# Altium schematic sheet CPU.SchDoc
size A4
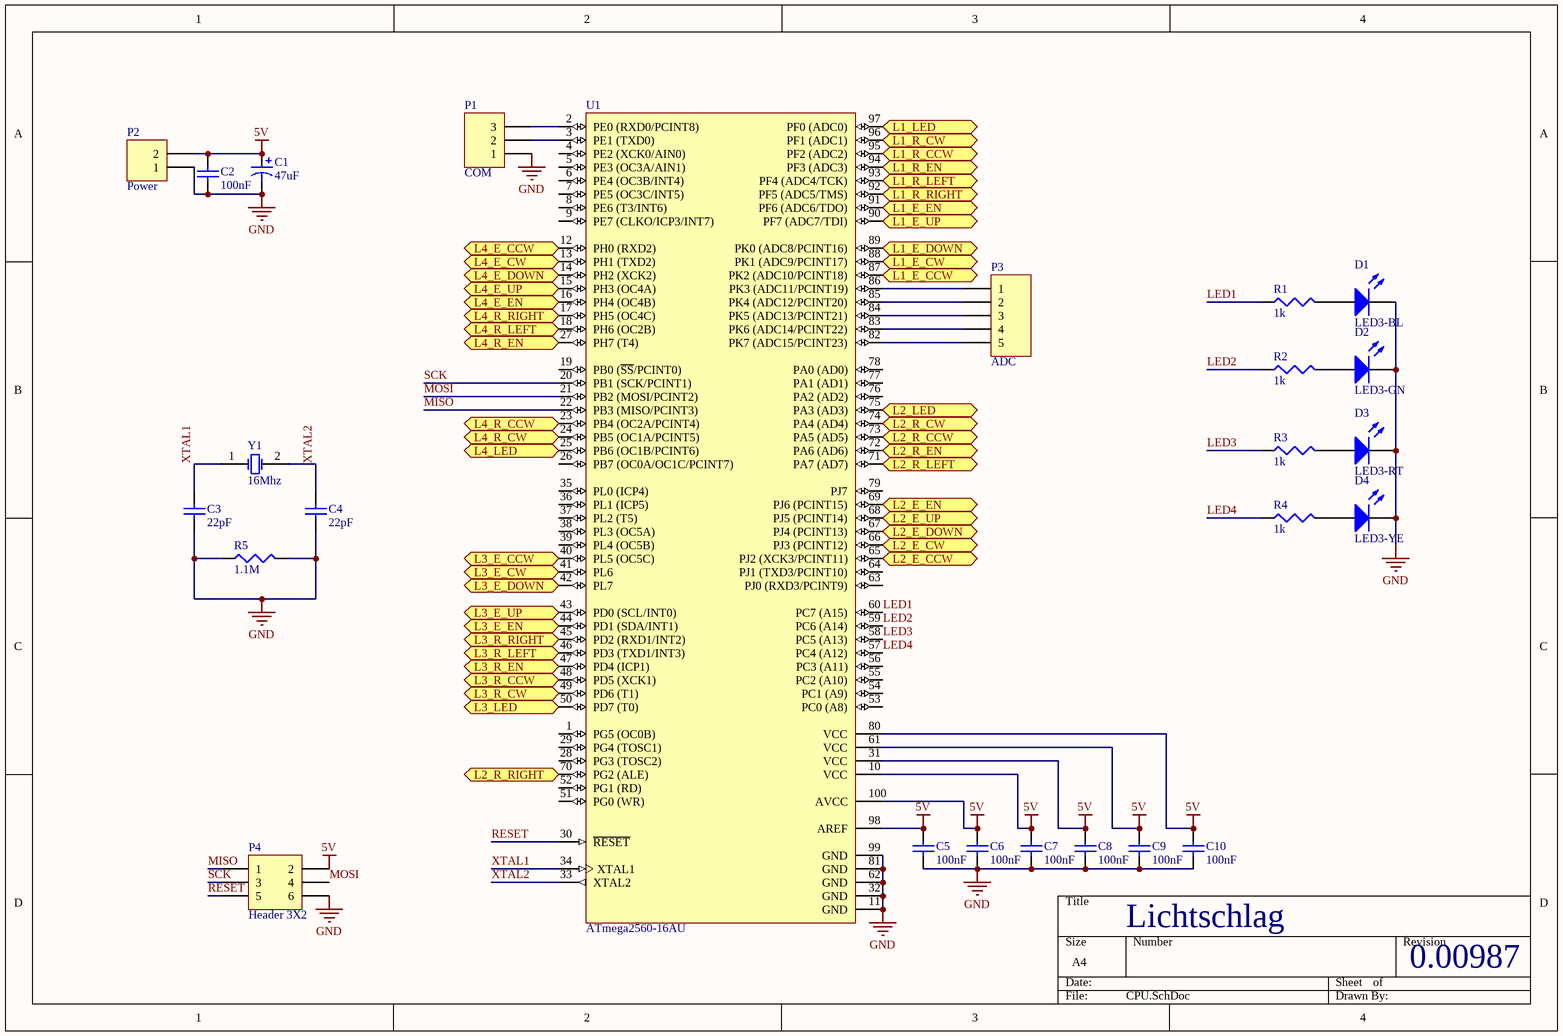
[diagram p0: CPU.SchDoc]

## Parts
C1  47uF  [2220]
C2  100nF  [2220]
C3  22pF  [6-0805_N]
C4  22pF  [6-0805_N]
C5  100nF  [2220]
C6  100nF  [2220]
C7  100nF  [2220]
C8  100nF  [2220]
C9  100nF  [2220]
C10  100nF  [2220]
D1  LED3-BL  [6-0805_N]
D2  LED3-GN  [6-0805_N]
D3  LED3-RT  [6-0805_N]
D4  LED3-YE  [6-0805_N]
P1  COM  [HDR1X3]
P2  Power  [HDR1X2]
P3  ADC  [HDR1X5]
P4  Header 3X2  [HDR2X3]
R1  1k  [6-0805_N]
R2  1k  [6-0805_N]
R3  1k  [6-0805_N]
R4  1k  [6-0805_N]
R5  1.1M  [6-0805_N]
U1  ATmega2560-16AU  [100A_M]
Y1  16Mhz  [R38]

## Ports
L1_E_CCW (in), L1_E_CW (in), L1_E_DOWN (out), L1_E_EN (out), L1_E_UP (out), L1_LED (out), L1_R_CCW (in), L1_R_CW (in), L1_R_EN (out), L1_R_LEFT (out), L1_R_RIGHT (out), L2_E_CCW (in), L2_E_CW (in), L2_E_DOWN (out), L2_E_EN (out), L2_E_UP (out), L2_LED (out), L2_R_CCW (in), L2_R_CW (in), L2_R_EN (out), L2_R_LEFT (out), L2_R_RIGHT (out), L3_E_CCW (in), L3_E_CW (in), L3_E_DOWN (out), L3_E_EN (out), L3_E_UP (out), L3_LED (out), L3_R_CCW (in), L3_R_CW (in), L3_R_EN (out), L3_R_LEFT (out), L3_R_RIGHT (out), L4_E_CCW (in), L4_E_CW (in), L4_E_DOWN (out), L4_E_EN (out), L4_E_UP (out), L4_LED (out), L4_R_CCW (in), L4_R_CW (in), L4_R_EN (out), L4_R_LEFT (out), L4_R_RIGHT (out)

## Nets
5V: C1.1 C2.2 C5.2 C6.2 C7.2 C8.2 C9.2 C10.2 P2.2 P4.2 U1.10(VCC) U1.31(VCC) U1.61(VCC) U1.80(VCC) U1.98(AREF) U1.100(AVCC)
GND: C1.2 C2.1 C3.1 C4.1 C5.1 C6.1 C7.1 C8.1 C9.1 C10.1 D1.2(K) D2.2(K) D3.2(K) D4.2(K) P1.1 P2.1 P4.6 R5.1 R5.2 U1.11(GND) U1.32(GND) U1.62(GND) U1.81(GND) U1.99(GND)
L1_E_CCW: U1.87(PK2_(ADC10/PCINT18)) ; port L1_E_CCW
L1_E_CW: U1.88(PK1_(ADC9/PCINT17)) ; port L1_E_CW
L1_E_DOWN: U1.89(PK0_(ADC8/PCINT16)) ; port L1_E_DOWN
L1_E_EN: U1.91(PF6_(ADC6/TDO)) ; port L1_E_EN
L1_E_UP: U1.90(PF7_(ADC7/TDI)) ; port L1_E_UP
L1_LED: U1.97(PF0_(ADC0)) ; port L1_LED
L1_R_CCW: U1.95(PF2_(ADC2)) ; port L1_R_CCW
L1_R_CW: U1.96(PF1_(ADC1)) ; port L1_R_CW
L1_R_EN: U1.94(PF3_(ADC3)) ; port L1_R_EN
L1_R_LEFT: U1.93(PF4_(ADC4/TCK)) ; port L1_R_LEFT
L1_R_RIGHT: U1.92(PF5_(ADC5/TMS)) ; port L1_R_RIGHT
L2_E_CCW: U1.65(PJ2_(XCK3/PCINT11)) ; port L2_E_CCW
L2_E_CW: U1.66(PJ3_(PCINT12)) ; port L2_E_CW
L2_E_DOWN: U1.67(PJ4_(PCINT13)) ; port L2_E_DOWN
L2_E_EN: U1.69(PJ6_(PCINT15)) ; port L2_E_EN
L2_E_UP: U1.68(PJ5_(PCINT14)) ; port L2_E_UP
L2_LED: U1.75(PA3_(AD3)) ; port L2_LED
L2_R_CCW: U1.73(PA5_(AD5)) ; port L2_R_CCW
L2_R_CW: U1.74(PA4_(AD4)) ; port L2_R_CW
L2_R_EN: U1.72(PA6_(AD6)) ; port L2_R_EN
L2_R_LEFT: U1.71(PA7_(AD7)) ; port L2_R_LEFT
L2_R_RIGHT: U1.70(PG2_(ALE)) ; port L2_R_RIGHT
L3_E_CCW: U1.40(PL5_(OC5C)) ; port L3_E_CCW
L3_E_CW: U1.41(PL6) ; port L3_E_CW
L3_E_DOWN: U1.42(PL7) ; port L3_E_DOWN
L3_E_EN: U1.44(PD1_(SDA/INT1)) ; port L3_E_EN
L3_E_UP: U1.43(PD0_(SCL/INT0)) ; port L3_E_UP
L3_LED: U1.50(PD7_(T0)) ; port L3_LED
L3_R_CCW: U1.48(PD5_(XCK1)) ; port L3_R_CCW
L3_R_CW: U1.49(PD6_(T1)) ; port L3_R_CW
L3_R_EN: U1.47(PD4_(ICP1)) ; port L3_R_EN
L3_R_LEFT: U1.46(PD3_(TXD1/INT3)) ; port L3_R_LEFT
L3_R_RIGHT: U1.45(PD2_(RXD1/INT2)) ; port L3_R_RIGHT
L4_E_CCW: U1.12(PH0_(RXD2)) ; port L4_E_CCW
L4_E_CW: U1.13(PH1_(TXD2)) ; port L4_E_CW
L4_E_DOWN: U1.14(PH2_(XCK2)) ; port L4_E_DOWN
L4_E_EN: U1.16(PH4_(OC4B)) ; port L4_E_EN
L4_E_UP: U1.15(PH3_(OC4A)) ; port L4_E_UP
L4_LED: U1.25(PB6_(OC1B/PCINT6)) ; port L4_LED
L4_R_CCW: U1.23(PB4_(OC2A/PCINT4)) ; port L4_R_CCW
L4_R_CW: U1.24(PB5_(OC1A/PCINT5)) ; port L4_R_CW
L4_R_EN: U1.27(PH7_(T4)) ; port L4_R_EN
L4_R_LEFT: U1.18(PH6_(OC2B)) ; port L4_R_LEFT
L4_R_RIGHT: U1.17(PH5_(OC4C)) ; port L4_R_RIGHT
LED1: R1.1 U1.60(PC7_(A15))
LED2: R2.1 U1.59(PC6_(A14))
LED3: R3.1 U1.58(PC5_(A13))
LED4: R4.1 U1.57(PC4_(A12))
MISO: P4.1 U1.22(PB3_(MISO/PCINT3))
MOSI: P4.4 U1.21(PB2_(MOSI/PCINT2))
RESET: P4.5 U1.30(~{RESET})
SCK: P4.3 U1.20(PB1_(SCK/PCINT1))
XTAL1: C3.2 U1.34(XTAL1) Y1.1(OSC1)
XTAL2: C4.2 U1.33(XTAL2) Y1.2(OSC2)
NetD1_1: D1.1(A) R1.2
NetD2_1: D2.1(A) R2.2
NetD3_1: D3.1(A) R3.2
NetD4_1: D4.1(A) R4.2
NetP1_2: P1.2 U1.3(PE1_(TXD0))
NetP1_3: P1.3 U1.2(PE0_(RXD0/PCINT8))
NetP3_1: P3.1 U1.86(PK3_(ADC11/PCINT19))
NetP3_2: P3.2 U1.85(PK4_(ADC12/PCINT20))
NetP3_3: P3.3 U1.84(PK5_(ADC13/PCINT21))
NetP3_4: P3.4 U1.83(PK6_(ADC14/PCINT22))
NetP3_5: P3.5 U1.82(PK7_(ADC15/PCINT23))

Not connected (* = marked no-connect by the designer): U1 1(PG5_(OC0B)) 4(PE2_(XCK0/AIN0)) 5(PE3_(OC3A/AIN1)) 6(PE4_(OC3B/INT4)) 7(PE5_(OC3C/INT5)) 8(PE6_(T3/INT6)) 9(PE7_(CLKO/ICP3/INT7)) 19(PB0_(~{SS}/PCINT0)) 26(PB7_(OC0A/OC1C/PCINT7)) 28(PG3_(TOSC2)) 29(PG4_(TOSC1)) 35(PL0_(ICP4)) 36(PL1_(ICP5)) 37(PL2_(T5)) 38(PL3_(OC5A)) 39(PL4_(OC5B)) 51(PG0_(WR)) 52(PG1_(RD)) 53(PC0_(A8)) 54(PC1_(A9)) 55(PC2_(A10)) 56(PC3_(A11)) 63(PJ0_(RXD3/PCINT9)) 64(PJ1_(TXD3/PCINT10)) 76(PA2_(AD2)) 77(PA1_(AD1)) 78(PA0_(AD0)) 79(PJ7)

## Notes on the sheet
- Lichtschlag
- 0.00987

## Library data of the parts
C1 = Cap Pol3: Polarized Capacitor (Surface Mount); Published: 8-Jun-2000; LatestRevisionDate: 29-May-2009; LatestRevisionNote: IPC-7351 Footprint Added.; PackageReference: C0805; Publisher: Altium Limited; PackageDescription: Chip Capacitor; Value: 47uF; Reichelt: https://secure.reichelt.de/Wima-FKS2-FKC2-FKP2/SMD-2220-47N/3//index.html?ACTION=3&GROUPID=3151&ARTICLE=18984&SEARCH=47%20uF%20SMD&OFFSET=16&WKID=0&
C2-C10 = Cap Semi: Capacitor (Semiconductor SIM Model); Published: 8-Jun-2000; LatestRevisionDate: 29-May-2009; LatestRevisionNote: IPC-7351 Footprint Added.; PackageReference: C1206; Publisher: Altium Limited; PackageDescription: Chip Capacitor
  C2 C5-C10: Value: 100nF; Reichelt: https://secure.reichelt.de/Wima-FKS2-FKC2-FKP2/SMD-2220N-100N/3//index.html?ACTION=3&GROUPID=3151&ARTICLE=31415&SEARCH=100%20nF&OFFSET=16&WKID=0&
  C3 C4: Value: 22pF; Reichelt: https://secure.reichelt.de/Vielschicht-SMD-G0805/NPO-G0805-22P/3//index.html?ACTION=3&GROUPID=3165&ARTICLE=13517&SEARCH=22%20pF&OFFSET=16&WKID=0&
D1-D4 = LED3: Typical BLUE SiC LED; Published: 8-Jun-2000; LatestRevisionDate: 17-Dec-2003; LatestRevisionNote: PCB Footprint replaced.; DatasheetVersion: 16-Apr-2002; PackageVersion: 16-Apr-2002; PackageReference: 3.5X2.8X1.9; Publisher: Altium Limited; PackageDescription: SM LED; 2 C-Bend Leads; Body 3.5 x 2.8 x 1.9 mm, inc leads (LxWxH typ)
  D1: Reichelt: https://www.reichelt.de/SMD-LED-0805-BL/3/index.html?&ACTION=3&LA=446&ARTICLE=31438&artnr=SMD-LED+0805+BL&SEARCH=LED+SMD+0805
  D2: Reichelt: https://www.reichelt.de/SMD-LED-0805-GN/3/index.html?&ACTION=3&LA=446&ARTICLE=31436&artnr=SMD-LED+0805+GN&SEARCH=LED+SMD+0805
  D3: Reichelt: https://www.reichelt.de/SMD-LED-0805-RT/3/index.html?&ACTION=3&LA=446&ARTICLE=31435&artnr=SMD-LED+0805+RT&SEARCH=LED+SMD+0805
  D4: Reichelt: https://www.reichelt.de/SMD-LED-0805-GE/3/index.html?&ACTION=3&LA=446&ARTICLE=31437&artnr=SMD-LED+0805+GE&SEARCH=LED+SMD+0805
P1 = Header 3: Header, 3-Pin; LatestRevisionDate: 17-Jul-2002; LatestRevisionNote: Re-released for DXP Platform.; Publisher: Altium Limited
P2 = Header 2: Header, 2-Pin; LatestRevisionDate: 17-Jul-2002; LatestRevisionNote: Re-released for DXP Platform.; Publisher: Altium Limited; Reichelt: https://secure.reichelt.de/RIA-Stecksystem/AKL-101-02/3//index.html?ACTION=3&GROUPID=5754&ARTICLE=36605&SEARCH=AKL%20101-02&OFFSET=16&WKID=0&
P3 = Header 5: Header, 5-Pin; LatestRevisionDate: 17-Jul-2002; LatestRevisionNote: Re-released for DXP Platform.; Publisher: Altium Limited
P4 = Header 3X2: Header, 3-Pin, Dual row; LatestRevisionDate: 17-Jul-2002; LatestRevisionNote: Re-released for DXP Platform.; Publisher: Altium Limited; Reichelt: https://secure.reichelt.de/Pfosten-Wannenstecker/WSL-6G/3//index.html?ACTION=3&GROUPID=3231&ARTICLE=85732&SEARCH=wsl%206g&OFFSET=16&WKID=0&
R1-R5 = Res3: Resistor; Published: 8-Jun-2000; LatestRevisionDate: 29-May-2009; LatestRevisionNote: IPC-7351 Footprint Added.; PackageReference: J1-0603; Publisher: Altium Limited; PackageDescription: Chip Resistor
  R1-R4: Value: 1k; Reichelt: https://secure.reichelt.de/SMD-0-1-0805-1-0-kOhm-9-53-kOhm/SPR-0805-2-21K/3//index.html?ACTION=3&GROUPID=5557&ARTICLE=123267&SEARCH=1k%20SMD%200805&OFFSET=16&WKID=0&
  R5: Value: 1.1M; Reichelt: https://secure.reichelt.de/SMD-0805-1-00-M-Ohm-10-0-M-Ohm/SMD-0805-1-00M/3//index.html?ACTION=3&GROUPID=3100&ARTICLE=32922&SEARCH=1.1%20SMD%200805&OFFSET=16&WKID=0&
U1 = CMP-0095-00210-2: 8-bit AVR Microcontroller, 4.5-5.5V, 16MHz, 256KB Flash, 4KB EEPROM, 8KB SRAM, 86 GPIO pins, 100-pin TQFP, Industrial Grade (-40°C to 85°C), Pb-Free; PackageDescription: 100-Pin Thin Profile Plastic Quad Flat Pack (TQFP), 14 x 14 x 1.0 mm Body, 0.5 mm Pitch; ComponentLink1Description: Manufacturer URL; ComponentLink3URL: http://www.atmel.com/dyn/resources/prod_documents/2549S.pdf; RevisionNote: DatasheetVersion & PackageVersion updated. URLs added.; DatasheetVersion: revN, May-2011; ComponentLink2Description: ATmega640/1280/1281/2560/2561 Datasheet; PackageReference: 100A; PackageVersion: revD, Oct-2010; Code_JEDEC: MS-026-AED; ComponentLink1URL: http://www.atmel.com/; ComponentLink2URL: http://www.atmel.com/dyn/resources/prod_documents/doc2549.pdf; ComponentLink3Description: ATmega640/1280/1281/2560/2561 Summary; Reichelt: https://secure.reichelt.de/Atmel-ATMega-AVRs/ATMEGA-2560-16AU/3//index.html?ACTION=3&GROUPID=2959&ARTICLE=68178&SEARCH=ATMEGA%202560-16AU&OFFSET=16&WKID=0&
Y1 = XTAL: Crystal Oscillator; Published: 8-Jun-2000; LatestRevisionDate: 17-Jul-2002; LatestRevisionNote: Re-released for DXP Platform.; PackageReference: R38; Publisher: Altium Limited; PackageDescription: Crystal, Thru-Hole; 2 Leads; Body 3.1 x 8.2 mm (Dia.xH); Reichelt: https://secure.reichelt.de/Quarze/16-0000-HC49U-S/3//index.html?ACTION=3&GROUPID=3173&ARTICLE=32852&SEARCH=Quarze&OFFSET=16&WKID=0&